# Altium schematic sheet FAN.SchDoc
size A4
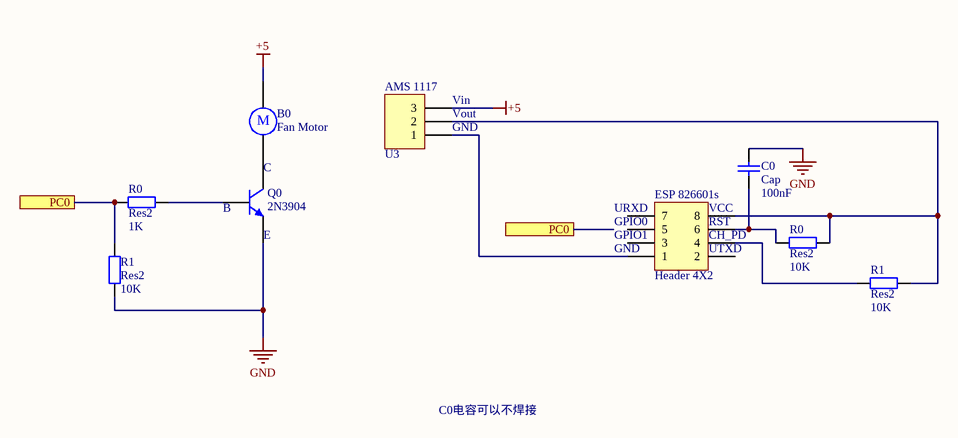
[diagram p0: FAN.SchDoc]

## Parts
(Parts that share a designator on the sheet are numbered #1, #2 ... from top to bottom, then left to right.)
AMS_1117  U3  [HDR1X3]
B0  Fan Motor  [RB5-10.5]
C0  Cap  value 100nF  [RAD-0.3]
ESP_826601s  Header 4X2  [HDR2X4]
Q0  2N3904  [TO-92A]
R0#1  Res2  value 1K  [AXIAL-0.4]
R0#2  Res2  value 10K  [AXIAL-0.4]
R1#1  Res2  value 10K  [AXIAL-0.4]
R1#2  Res2  value 10K  [AXIAL-0.4]

## Ports
PC0

## Nets
+5: AMS_1117.3 B0.1
GND: C0.2 Q0.1(E) R1#1.2
PC0: R0#1.1 R1#1.1 ; port PC0
NetAMS_1117_1: AMS_1117.1 ESP_826601s.1
NetAMS_1117_2: AMS_1117.2 ESP_826601s.8 R0#2.1 R1#2.1
NetB0_2: B0.2 Q0.3(C)
NetC0_1: C0.1 ESP_826601s.6 R0#2.2
NetESP_826601s_4: ESP_826601s.4 R1#2.2
NetQ0_2: Q0.2(B) R0#1.2

Not connected (* = marked no-connect by the designer): ESP_826601s 2 3 5 7

## Notes on the sheet
- (near AMS_1117) Vin
- (near Q0) C
- (near AMS_1117) GND
- (near AMS_1117) Vout
- (near Q0) B
- (near Q0) E
- (near ESP_826601s) GPIO1
- (near ESP_826601s) GPIO0
- (near ESP_826601s) URXD
- (near ESP_826601s) CH_PD
- (near ESP_826601s) RST
- (near ESP_826601s) VCC
- (near ESP_826601s) GND
- (near ESP_826601s) UTXD
- C0电容可以不焊接
- (in symbol Motor) M

## Library data of the parts
AMS_1117 = Header 3: Header, 3-Pin; LatestRevisionDate: 17-Jul-2002; LatestRevisionNote: Re-released for DXP Platform.; Publisher: Altium Limited
B0 = Motor: Motor, General Kind; Published: 24-Mar-1999; LatestRevisionDate: 17-Jul-2002; LatestRevisionNote: Re-released for DXP Platform.; PackageReference: RB5-10.5; Publisher: Altium Limited; PackageDescription: Capacitor (Radial); 2 Leads
C0 = Cap: Capacitor; Published: 8-Jun-2000; LatestRevisionDate: 17-Jul-2002; LatestRevisionNote: Re-released for DXP Platform.; PackageReference: RAD-0.3; Publisher: Altium Limited; PackageDescription: Radial Cap, Thru-Hole; 2 Leads; 0.3 in Pin Spacing
ESP_826601s = Header 4X2: Header, 4-Pin, Dual row; LatestRevisionDate: 17-Jul-2002; LatestRevisionNote: Re-released for DXP Platform.; Publisher: Altium Limited
Q0 = 2N3904: NPN General Purpose Amplifier; Published: 8-Jun-2000; LatestRevisionDate: 15-Jan-2003; LatestRevisionNote: PCB Footprint 'BCY-W3/D4.7' replaced; DatasheetVersion: 1997; PackageVersion: Sep-1998; PackageReference: TO-92A; Publisher: Altium Limited; PackageDescription: TO, Flat Index; 3 In-Line, Axial Leads; Body Dia. 4.5mm; Leads 0.51 x 0.48 mm (max); ComponentLink1Description: Manufacturer Link; ComponentLink1URL: http://www.fairchildsemi.com/; ComponentLink2Description: Datasheet; ComponentLink2URL: http://www.fairchildsemi.com/ds/2N%2F2N3904.pdf
R0#1 R0#2 R1#1 R1#2 = Res2: Resistor; Published: 8-Jun-2000; LatestRevisionDate: 17-Jul-2002; LatestRevisionNote: Re-released for DXP Platform.; PackageReference: AXIAL-0.4; Publisher: Altium Limited; PackageDescription: Axial Device, Thru-Hole; 2 Leads; 0.4 in Pin Spacing